# Altium schematic sheet MagController.SchDoc
size A
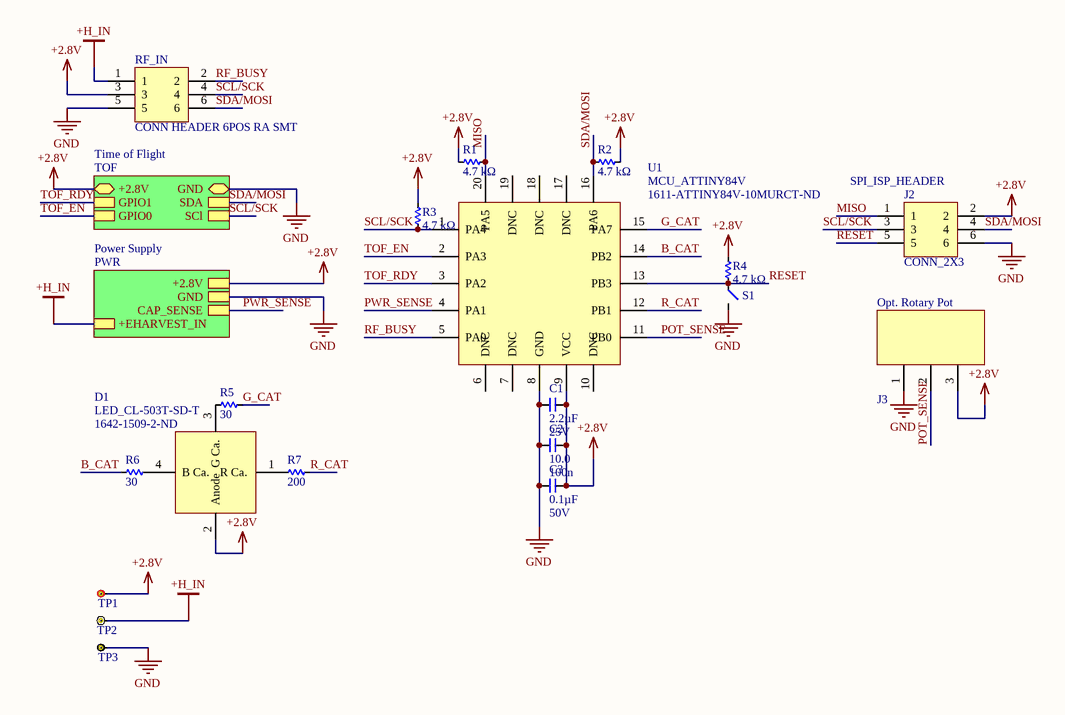
[diagram p0: MagController.SchDoc]

## Parts
C1  Capacitance (shorthand): 2.2µF  Rated Voltage: 25V  [C0603]  (hidden comment: __template_cap)
C2  voltage: 10.0  human_value: 100n  [C0402]  (hidden comment: 399-3520-1-ND)
C3  Capacitance (shorthand): 0.1µF  Rated Voltage: 50V  [C0805]  (hidden comment: __template_cap)
D1  LED_CL-503T-SD-T  Supplier Part Number 1: 1642-1509-2-ND  [LED_RGB_CL-503T-SD-T]
J2  CONN_2X3  [CONN_2x3_100MIL]
J3  CONN_1x3_640454-3  [CONN_1x3_100MIL]  (value not drawn)
R1  Resistance: 4.7 kΩ  [R0805]  (hidden comment: __template_resistor)
R2  Resistance: 4.7 kΩ  [R0805]  (hidden comment: __template_resistor)
R3  Resistance: 4.7 kΩ  [R0805]  (hidden comment: __template_resistor)
R4  Resistance: 4.7 kΩ  [R0805]  (hidden comment: __template_resistor)
R5  value 30  [R1206]  (hidden comment: __template_resistor)
R6  value 30  [R1206]  (hidden comment: __template_resistor)
R7  value 200  [R1206]  (hidden comment: __template_resistor)
RF_IN  CONN HEADER 6POS RA SMT  [CONN_2x3_100MIL]
S1  B3U-1000P  [SWITCH_B3U-1000P]  (value not drawn)
TP1  TEST_POINT_RED_KEYSTONE_5000  [TEST_POINT_KEYSTONE_5000]  (value not drawn)
TP2  TEST_POINT_WHITE_KEYSTONE_5002  [TEST_POINT_KEYSTONE_5002]  (value not drawn)
TP3  TEST_POINT_BLACK_KEYSTONE_5001  [TEST_POINT_KEYSTONE_5001]  (value not drawn)
U1  MCU_ATTINY84V  Supplier Part Number 1: 1611-ATTINY84V-10MURCT-ND  [20QFN4]

## Sub-sheets
Power Supply = PWR: GND, +2.8V, +EHARVEST_IN, CAP_SENSE
Time of Flight = TOF: GND (bidir), +2.8V (bidir), GPIO1, SDA, GPIO0, SCl

## Nets
+2.8V: C1.2 C2.2 C3.2 D1.2(Anode) J2.2 J3.3 R1.2 R2.2 R3.2 R4.2 RF_IN.3 TP1.1 U1.9(VCC) ; sheet Time of Flight/+2.8V, sheet Power Supply/+2.8V
+H_IN: RF_IN.1 TP2.1 ; sheet Power Supply/+EHARVEST_IN
GND: C1.1 C2.1 C3.1 J2.6 J3.1 RF_IN.5 S1.2 TP3.1 U1.8(GND) ; sheet Time of Flight/GND, sheet Power Supply/GND
B_CAT: R6.2 U1.14(PB2)
G_CAT: R5.2 U1.15(PA7)
MISO: J2.1 R1.1 U1.20(PA5)
POT_SENSE: J3.2 U1.11(PB0)
PWR_SENSE: U1.4(PA1) ; sheet Power Supply/CAP_SENSE
R_CAT: R7.2 U1.12(PB1)
RESET: J2.5 R4.1 S1.1 U1.13(PB3)
RF_BUSY: RF_IN.2 U1.5(PA0)
SCL/SCK: J2.3 R3.1 RF_IN.4 U1.1(PA4) ; sheet Time of Flight/SCl
SDA/MOSI: J2.4 R2.1 RF_IN.6 U1.16(PA6) ; sheet Time of Flight/SDA
TOF_EN: U1.2(PA3) ; sheet Time of Flight/GPIO0
TOF_RDY: U1.3(PA2) ; sheet Time of Flight/GPIO1
NetD1_1: D1.1(R_Ca.) R7.1
NetD1_3: D1.3(G_Ca.) R5.1
NetD1_4: D1.4(B_Ca.) R6.1

Not connected (* = marked no-connect by the designer): U1 6(DNC) 7(DNC) 10(DNC) 17(DNC) 18(DNC) 19(DNC)

## Notes on the sheet
- (near J2) SPI_ISP_HEADER
- Opt. Rotary Pot

## Library data of the parts
C1 = CAP CER 2.2UF 16V X5R 0603 10%: Manufacturer: Murata Electronics North America; Capacitance - pF (Machine readable): 2200000; type: capacitor; Dielectric: X5R; Supplier 1: Digikey; Supplier Part Number 1: 490-10731-1-ND
C2 = 399-3520-1-ND: type: capacitor; value: 1e-07; tolerance: 10%; Supplier Part Number 1: 399-3520-1-ND; package: 0402; price: 0.06
C3 = CAP CER 0.1UF 50V X7R 0805: Manufacturer: Murata Electronics North America; Capacitance - pF (Machine readable): 100000; type: capacitor; Dielectric: X7R; Supplier Part Number 1: 490-1666-1-ND
D1 = LED_CL-503T-SD-T: RGB LOW VOLTAGE RICOLOR TOP FIRING 1.5 X 1.3 X; Manufacturer: Citizen; Color: Red, Green, Blue (RGB); Configuration: Common Anode; Millicandela Rating: 36mcd Red, 180mcd Green, 40mcd Blue; Lens Style/Size: Rectangle with Flat Top, 1.30mm x 1.50mm; Voltage - Forward (Vf) (Typ): 1.85V Red, 2.7V Green, 2.75V Blue; Current - Test: 5mA Red, 5mA Green, 5mA Blue; Wavelength - Peak: 618nm Red, 530nm Green, 470nm Blue; Supplier 1: Digi-Key; Manufacturer Part Number: CL-503T-SD-T; RoHS: RoHS Compliant; Category: Optoelectronics; Stock 1: 15000; Pricing 1: 5000=0.2318, 10000=0.22836, 25000=0.22321 (USD); Packaging: Tape & Reel (TR); Part Status: Active; Lens Color: -; Lens Transparency: -; Viewing Angle: -; Mounting Type: Surface Mount; Wavelength - Dominant: -; Features: -; Package / Case: 4-SMD, No Lead; Supplier Device Package: -; Size / Dimension: 1.50mm L x 1.30mm W; Height (Max): 0.35mm; ComponentLink1URL: http://ce.citizen.co.jp/up_img/product/KF9Gun57LXzH/CL-503_e.pdf; ComponentLink1Description: http://ce.citizen.co.jp/up_img/product/KF9Gun57LXzH/CL-503_e.pdf
J3 = CONN_1x3_640454-3: CONN HEADER VERT 3POS .100 TIN; Manufacturer: TE Connectivity; Connector Type: Header, Unshrouded; Number of Positions: 3; Number of Positions Loaded: All; Pitch: 0.100" (2.54mm); Supplier 1: Digi-Key; Manufacturer Part Number: 640454-3; RoHS: RoHS Compliant; Category: Connectors, Interconnects; Stock 1: 6372; Pricing 1: 1=0.17, 10=0.162, 25=0.1204, 50=0.1032, 100=0.0997, 250=0.08592, 500=0.08248, 1000=0.07218, 2500=0.0653 (USD); Packaging: Bulk; Contact Type: Male Pin; Number of Rows: 1; Mounting Type: Through Hole; Termination: Solder; Fastening Type: -; Features: Polarizing Key; ComponentLink1URL: http://www.te.com/commerce/DocumentDelivery/DDEController?Action=srchrtrv&DocNm=640454&DocType=Customer+Drawing&DocLang=English; ComponentLink1Description: Datasheet; Supplier Part Number 1: A19430-ND; Row Spacing: -; Contact Mating Length: 0.295" (7.49mm); Contact Finish: Tin; Contact Finish Thickness: -; Color: Natural
R1-R4 = RES SMD 4.7K OHM 1% 1/8W 0805: Manufacturer Part Number: RC0805FR-074K7L; Manufacturer: Yageo; Resistance (Sortable): 4700; Tolerance: ±1%; Power (Watts): 0.125W, 1/8W; Temperature Coefficient: ±100ppm/°C; Supplier 1: Digikey; Datasheets: http://www.yageo.com/documents/recent/PYu-RC_Group_51_RoHS_L_9.pdf; Image: //media.digikey.com/Renders/Yageo%20Renders/0805-(2012-Metric).jpg; Supplier Part Number 1: 311-4.70KCRCT-ND; Operating Temperature: -55°C ~ 155°C
R5 R6 = RES SMD 30 OHM 1% 1/4W 1206: Manufacturer Part Number: CRCW120630R0FKEA; Manufacturer: Vishay Dale; Resistance (Machine readable): 30.00; Unit Price (USD): 0.102; Tolerance: ±1%; Power (Watts): 0.25W, 1/4W; Supplier Part Number: 541-30.0FCT-ND; type: resistor; Supplier 1: Digikey; Supplier Part Number 1: 541-30.0FCT-ND; Supplier 2: Mouser; Supplier Part Number 2: 71-CRCW1206-30-E3; Packaging: Cut Tape (CT); Series: CRCW; Package: 1206 (3216 Metric); Mouser PN Opt 1: 71-CRCW120630R0FKEA; Mouser PN Opt 2: 71-CRCW1206-30-E3
R7 = RES SMD 200 OHM 1% 1/4W 1206: Manufacturer Part Number: CRCW1206200RFKEA; Manufacturer: Vishay Dale; Resistance (Machine readable): 200.00; Unit Price (USD): 0.102; Tolerance: ±1%; Power (Watts): 0.25W, 1/4W; Supplier Part Number: 541-200FCT-ND; type: resistor; Supplier 1: Digikey; Supplier Part Number 1: 541-200FCT-ND; Supplier 2: Mouser; Supplier Part Number 2: 71-CRCW1206-200-E3; Packaging: Cut Tape (CT); Series: CRCW; Package: 1206 (3216 Metric); Mouser PN Opt 1: 71-CRCW1206200RFKEA; Mouser PN Opt 2: 71-CRCW1206-200-E3
RF_IN = CONN_2X3: System: Connector
S1 = SWITCH_SPST-NO: SWITCH TACTILE SPST-NO 0.05A 12V; Manufacturer: Omron Electronics Inc-EMC Div; Switch Function: Off-Mom; Actuator Type: Standard; Actuator Height off PCB, from Pins: 1.60mm; Actuator Orientation: Top Actuated; Outline: 3.00mm x 2.50mm; Illumination: Non-Illuminated; Operating Force: 153gf; Ingress Protection: Dust Proof; Switch Travel: 0.15mm; Mechanical Life: 200,000 Cycles; Contact Rating @ Voltage: 0.05A @ 12VDC; Supplier 1: Digi-Key; Manufacturer Part Number: B3U-1000P; RoHS: RoHS Compliant; Category: Switches; Stock 1: 16437; Pricing 1: 1=1.25, 10=1.201, 25=1.1332, 50=0.997, 100=0.9064, 250=0.86108, 500=0.83842, 1000=0.65714 (USD); Circuit: SPST-NO; Mounting Type: Surface Mount; Termination Style: SMD (SMT) Tab; Illumination Voltage (Nominal): -; Illumination Type, Color: -; Features: -; Packaging: Cut Tape (CT); Actuator Material: -; Operating Temperature: -25°C ~ 70°C; ComponentLink1URL: http://components.omron.com/components/web/pdflib.nsf/0/2DD3893C7DD33E9E862572900079E9D6/$file/B3U_1110.pdf; ComponentLink1Description: http://components.omron.com/components/web/pdflib.nsf/0/2DD3893C7DD33E9E862572900079E9D6/$file/B3U_1110.pdf; Supplier Part Number 1: SW1020CT-ND
TP1 = TEST_POINT_RED_KEYSTONE_5000: RED T/H TEST POINT; Manufacturer: Keystone Electronics; Manufacturer Part Number: 5000; Plating: Silver; Material - Insulation: Nylon 46, UL 94V-0; Material - Body: Phosphor Bronze; Supplier 1: Digi-Key; RoHS: RoHS Compliant; Category: Test and Measurement; Stock 1: 399527; Pricing 1: 1=0.37, 10=0.316, 50=0.2298, 100=0.2209, 250=0.19832, 500=0.18932, 1000=0.1616, 2500=0.14424, 5000=0.13523 (USD); Packaging: Bulk; Part Status: Active; Type: PC Test Point, Miniature; Mounting Type: 0.040" (1.02mm) Hole Diameter; Color: Red; Size / Dimension: 0.100" Dia x 0.180" L (2.54mm x 4.57mm); ComponentLink1URL: http://www.keyelco.com/product-pdf.cfm?p=1309; ComponentLink1Description: http://www.keyelco.com/product-pdf.cfm?p=1309; Supplier Part Number 1: 36-5000-ND
TP2 = TEST_POINT_WHITE_KEYSTONE_5002: WHITE T/H TEST POINT; Manufacturer: Keystone Electronics; Manufacturer Part Number: 5002; Plating: Silver; Material - Insulation: Nylon 46, UL 94V-0; Material - Body: Phosphor Bronze; Supplier 1: Digi-Key; RoHS: RoHS Compliant; Category: Test and Measurement; Stock 1: 460002; Pricing 1: 1=0.37, 10=0.316, 50=0.2298, 100=0.2209, 250=0.19832, 500=0.18932, 1000=0.1616, 2500=0.14424, 5000=0.13523 (USD); Packaging: Bulk; Part Status: Active; Type: PC Test Point, Miniature; Mounting Type: 0.040" (1.02mm) Hole Diameter; Color: White; Size / Dimension: 0.100" Dia x 0.180" L (2.54mm x 4.57mm); ComponentLink1URL: http://www.keyelco.com/product-pdf.cfm?p=1311; ComponentLink1Description: http://www.keyelco.com/product-pdf.cfm?p=1311; Supplier Part Number 1: 36-5002-ND
TP3 = TEST_POINT_BLACK_KEYSTONE_5001: BLACK T/H TEST POINT; Manufacturer: Keystone Electronics; Manufacturer Part Number: 5001; Plating: Silver; Material - Insulation: Nylon 46, UL 94V-0; Material - Body: Phosphor Bronze; Supplier 1: Digi-Key; RoHS: RoHS Compliant; Category: Test and Measurement; Stock 1: 718799; Pricing 1: 1=0.37, 10=0.316, 50=0.2298, 100=0.2209, 250=0.19832, 500=0.18932, 1000=0.1616, 2500=0.14424, 5000=0.13523 (USD); Packaging: Bulk; Part Status: Active; Type: PC Test Point, Miniature; Mounting Type: 0.040" (1.02mm) Hole Diameter; Color: Black; Size / Dimension: 0.100" Dia x 0.180" L (2.54mm x 4.57mm); ComponentLink1URL: http://www.keyelco.com/product-pdf.cfm?p=1310; ComponentLink1Description: http://www.keyelco.com/product-pdf.cfm?p=1310; Supplier Part Number 1: 36-5001-ND
U1 = MCU_ATTINY84V: Attiny84 Surface Mount Extended Voltage Range; Manufacturer: Microchip Technology; Manufacturer Part Number: ATTINY84V-10MUR; Core Processor: AVR; Core Size: 8-Bit; Speed: 10MHz; Connectivity: USI; Peripherals: Brown-out Detect/Reset, POR, PWM, Temp Sensor, WDT; Program Memory Size: 8KB (4K x 16); Program Memory Type: FLASH; EEPROM Size: 512 x 8; Voltage - Supply (Vcc/Vdd): 1.8 V ~ 5.5 V; Data Converters: A/D 8x10b; Oscillator Type: Internal; Supplier 1: Digi-Key; RoHS: RoHS Compliant; Category: Integrated Circuits (ICs); Stock 1: 9687; Pricing 1: 1=1.01, 25=0.92, 100=0.835 (USD); Packaging: Cut Tape (CT); Part Status: Active; RAM Size: 512 x 8; Operating Temperature: -40°C ~ 85°C (TA); Package / Case: 20-WFQFN Exposed Pad; Supplier Device Package: 20-QFN-EP (4x4)